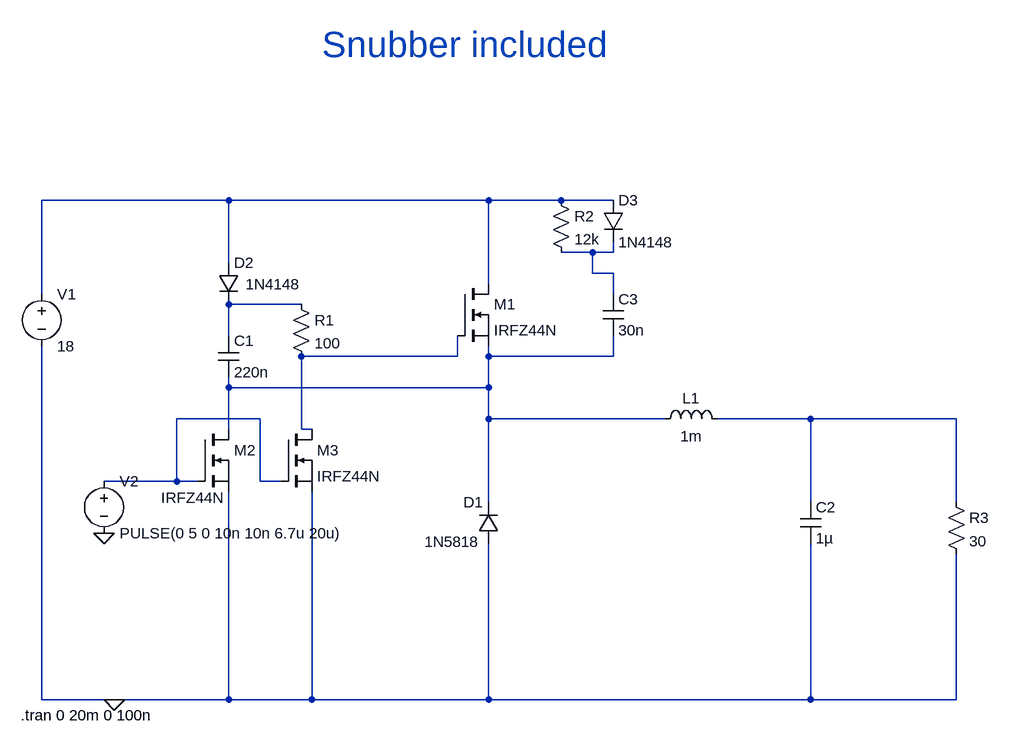
[diagram p0: schematic LED driver_3.asc]
LED driver_3.asc, the LTspice schematic file:
Version 4.1
SHEET 1 2164 760
WIRE 256 -48 -32 -48
WIRE 656 -48 256 -48
WIRE 768 -48 656 -48
WIRE 848 -48 768 -48
WIRE 816 32 768 32
WIRE 848 32 848 16
WIRE 848 32 816 32
WIRE 256 48 256 -48
WIRE 816 64 816 32
WIRE 848 64 816 64
WIRE 656 80 656 -48
WIRE -32 96 -32 -48
WIRE 848 96 848 64
WIRE 368 112 256 112
WIRE 256 160 256 112
WIRE 608 192 608 160
WIRE 608 192 368 192
WIRE 656 192 656 176
WIRE 848 192 848 160
WIRE 848 192 656 192
WIRE 256 240 256 224
WIRE 656 240 656 192
WIRE 656 240 256 240
WIRE 304 288 176 288
WIRE 656 288 656 240
WIRE 928 288 656 288
WIRE 1152 288 1008 288
WIRE 1376 288 1152 288
WIRE 256 304 256 240
WIRE 368 304 368 192
WIRE 384 304 368 304
WIRE 176 384 176 288
WIRE 176 384 64 384
WIRE 208 384 176 384
WIRE 304 384 304 288
WIRE 336 384 304 384
WIRE 656 416 656 288
WIRE 1152 416 1152 288
WIRE 1376 416 1376 288
WIRE -32 720 -32 176
WIRE 80 720 -32 720
WIRE 256 720 256 400
WIRE 256 720 80 720
WIRE 384 720 384 400
WIRE 384 720 256 720
WIRE 656 720 656 480
WIRE 656 720 384 720
WIRE 1152 720 1152 480
WIRE 1152 720 656 720
WIRE 1376 720 1376 496
WIRE 1376 720 1152 720
FLAG 80 720 0
FLAG 64 464 0
SYMBOL voltage -32 80 R0
SYMATTR InstName V1
SYMATTR Value 18
SYMBOL diode 672 480 R180
WINDOW 0 24 64 Left 2
WINDOW 3 30 3 Left 2
SYMATTR InstName D1
SYMATTR Value 1N5818
SYMBOL ind 912 304 R270
WINDOW 0 32 56 VTop 2
WINDOW 3 5 56 VBottom 2
SYMATTR InstName L1
SYMATTR Value 1m
SYMBOL cap 1136 416 R0
SYMATTR InstName C2
SYMATTR Value 1µ
SYMBOL res 1360 400 R0
SYMATTR InstName R3
SYMATTR Value 30
SYMBOL nmos 608 80 R0
SYMATTR InstName M1
SYMATTR Value IRFZ44N
SYMBOL diode 240 48 R0
WINDOW 3 42 33 Left 2
SYMATTR Value 1N4148
SYMATTR InstName D2
SYMBOL cap 240 160 R0
SYMATTR InstName C1
SYMATTR Value 220n
SYMBOL res 352 96 R0
SYMATTR InstName R1
SYMATTR Value 100
SYMBOL nmos 208 304 R0
WINDOW 3 -56 105 Left 2
SYMATTR Value IRFZ44N
SYMATTR InstName M2
SYMBOL nmos 336 304 R0
SYMATTR InstName M3
SYMATTR Value IRFZ44N
SYMBOL voltage 64 368 R0
WINDOW 123 0 0 Left 0
WINDOW 39 0 0 Left 0
SYMATTR InstName V2
SYMATTR Value PULSE(0 5 0 10n 10n 6.7u 20u)
SYMBOL cap 832 96 R0
SYMATTR InstName C3
SYMATTR Value 30n
SYMBOL diode 832 -48 R0
SYMATTR InstName D3
SYMATTR Value 1N4148
SYMBOL res 752 -64 R0
SYMATTR InstName R2
SYMATTR Value 12k
TEXT -64 744 Left 2 !.tran 0 20m 0 100n
TEXT 400 -288 Left 5 ;Snubber included

The netlist it stands for:
* LED driver_3.asc
V1 N001 0 18
D1 0 N005 1N5818
L1 N005 N007 1m
C2 N007 0 1µ
R3 N007 0 30
M1 N001 N004 N005 N005 IRFZ44N
D2 N001 N003 1N4148
C1 N003 N005 220n
R1 N003 N004 100
M2 N005 N006 0 0 IRFZ44N
M3 N004 N006 0 0 IRFZ44N
V2 N006 0 PULSE(0 5 0 10n 10n 6.7u 20u)
C3 N002 N005 30n
D3 N001 N002 1N4148
R2 N001 N002 12k
.model D D
.lib standard.dio
.model NMOS NMOS
.model PMOS PMOS
.lib standard.mos
.tran 0 20m 0 100n
* Snubber included
.backanno
.end